# Altium schematic sheet nm_sys_can_phy.SchDoc
size 209 x 297 mm; SheetNumber: 7; SheetTotal: 9
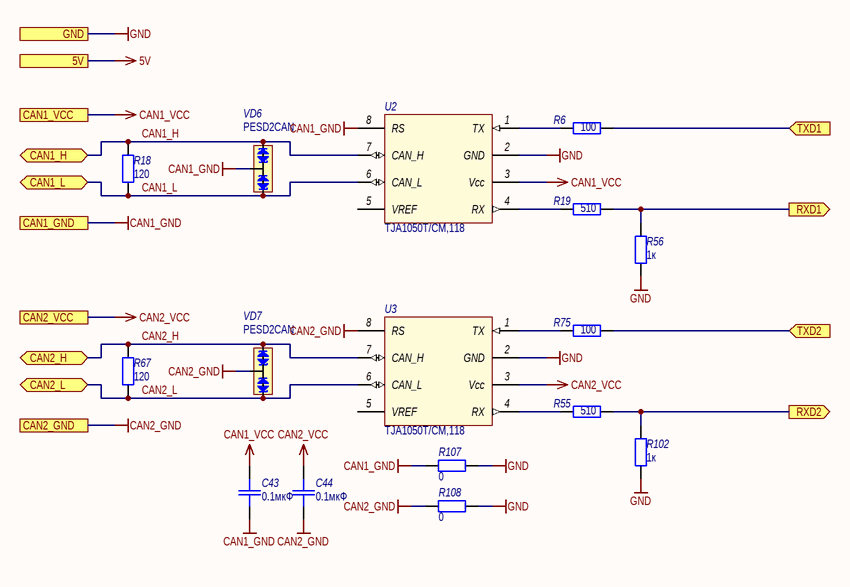
[diagram p0: nm_sys_can_phy.SchDoc]

## Parts
C43  0.1мкФ  [SMD_C0603]
C44  0.1мкФ  [SMD_C0603]
R6  value 100  [SMD_0603]  (hidden comment: Resistor)
R18  value 120  [SMD_0603]  (hidden comment: Resistor)
R19  value 510  [SMD_0603]  (hidden comment: Resistor)
R55  value 510  [SMD_0603]  (hidden comment: Resistor)
R56  value 1к  [SMD_0603]  (hidden comment: Resistor)
R67  value 120  [SMD_0603]  (hidden comment: Resistor)
R75  value 100  [SMD_0603]  (hidden comment: Resistor)
R102  value 1к  [SMD_0603]  (hidden comment: Resistor)
R107  value 0  [SMD_0603]  (hidden comment: Resistor)
R108  value 0  [SMD_0603]  (hidden comment: Resistor)
U2  Наименование: TJA1050T/CM,118  [SOIC-8]  (hidden comment: TJA1050)
U3  Наименование: TJA1050T/CM,118  [SOIC-8]  (hidden comment: TJA1050)
VD6  PESD2CAN  [SOT-23]
VD7  PESD2CAN  [SOT-23]

## Ports
5V, CAN1_GND, CAN1_H (bidir), CAN1_L (bidir), CAN1_VCC, CAN2_GND, CAN2_H (bidir), CAN2_L (bidir), CAN2_VCC, GND, RXD1 (out), RXD2 (out), TXD1 (in), TXD2 (in)

## Nets
5V: port 5V
CAN1_GND: C43.1 R107.2 U2.8(RS) VD6.3(CC) ; port CAN1_GND
CAN1_VCC: C43.2 U2.3(Vcc) ; port CAN1_VCC
CAN2_GND: C44.1 R108.2 U3.8(RS) VD7.3(CC) ; port CAN2_GND
CAN2_VCC: C44.2 U3.3(Vcc) ; port CAN2_VCC
GND: R56.1 R102.1 R107.1 R108.1 U2.2(GND) U3.2(GND) ; port GND
CAN1_H: R18.2 U2.7(CAN_H) VD6.2(C2) ; port CAN1_H
CAN1_L: R18.1 U2.6(CAN_L) VD6.1(C1) ; port CAN1_L
CAN2_H: R67.2 U3.7(CAN_H) VD7.2(C2) ; port CAN2_H
CAN2_L: R67.1 U3.6(CAN_L) VD7.1(C1) ; port CAN2_L
RXD1: R19.2 R56.2 ; port RXD1
RXD2: R55.2 R102.2 ; port RXD2
TXD1: R6.2 ; port TXD1
TXD2: R75.2 ; port TXD2
NetR6_1: R6.1 U2.1(TX)
NetR19_1: R19.1 U2.4(RX)
NetR55_1: R55.1 U3.4(RX)
NetR75_1: R75.1 U3.1(TX)

Not connected (* = marked no-connect by the designer): U2 5(VREF); U3 5(VREF)

## Notes on the sheet
- Подп. и дата
- Инв. № дубл.
- Взам. инв. №
- Инв. № подл.
- Изм.
- Лист
- № докум.
- Подп.
- Дата
- Форма 2а ГОСТ 2.104-2006
- Копировал
- Формат А4

## Library data of the parts
C43 C44 = Capacitor: Назначение: SMD-конденсатор; Наименование: Конденсатор; Потребление, Вт: 0; Точность: %; Напряжение: В; Value: 0.1мкФ; Диэлектрик: *; Place_v1: *; Place_v2: *
R6 R18 R19 R55 R56 R67 R75 R102 R107 R108 = Resistor: Наименование: Резистор; Назначение: SMD-резистор; Потребление, Вт: 0,001; Точность: %
  R6 R18 R19 R55 R56 R67 R75 R102: Place_v1: *; Place_v2: *
U2 U3 = TJA1050: Isolated CAN Transceiver; Назначение: CAN приемник; Потребление, Вт: 0,001; ComponentLink1Description: Datasheet; ComponentLink1URL: https://static.chipdip.ru/lib/205/DOC000205042.pdf; Place_v1: *; Place_v2: *
VD6 VD7 = PESD2CAN: CAN bus ESD protection diode; Назначение: Защитная диодная сборка CAN-шины от ЭСР; Потребление, Вт: 0,001; ComponentLink1Description: DataSheet; ComponentLink1URL: https://docviewer.yandex.ru/view/20572601/?*=RQqn8Wj9g8uNyA%2Fh5vLXNATrwhl7InVybCI6Imh0dHBzOi8vYXNzZXRzLm5leHBlcmlhLmNvbS9kb2N1bWVudHMvZGF0YS1zaGVldC9QRVNEMkNBTi5wZGYiLCJ0aXRsZSI6IlBFU0QyQ0FOLnBkZiIsIm5vaWZyYW1lIjp0cnVlLCJ1aWQiOiIyMDU3MjYwMSIsInRzIjoxNTk2Nzk0OTE4Njc4LCJ5dSI6Ijg4OTA2MTMzMTU0MzM4NzEyMSIsInNlcnBQYXJhbXMiOiJsYW5nPWVuJnRtPTE1OTY3OTQ4OTAmdGxkPXJ1Jm5hbWU9UEVTRDJDQU4ucGRmJnRleHQ9cGVzZDJjYW4mdXJsPWh0dHBzJTNBLy9hc3NldHMubmV4cGVyaWEuY29tL2RvY3VtZW50cy9kYXRhLXNoZWV0L1BFU0QyQ0FOLnBkZiZscj02NSZtaW1lPXBkZiZsMTBuPXJ1JnNpZ249MzE3ZjE4NzU1MTcwMWNmYmI4ZDQxYzc2OTNlYTFkYzIma2V5bm89MCJ9&lang=en; Наименование: PESD2CAN; Place_v1: *; Place_v2: *